# EAGLE schematic 8_RGB_SMD_LEDs (EAGLE 6.4)
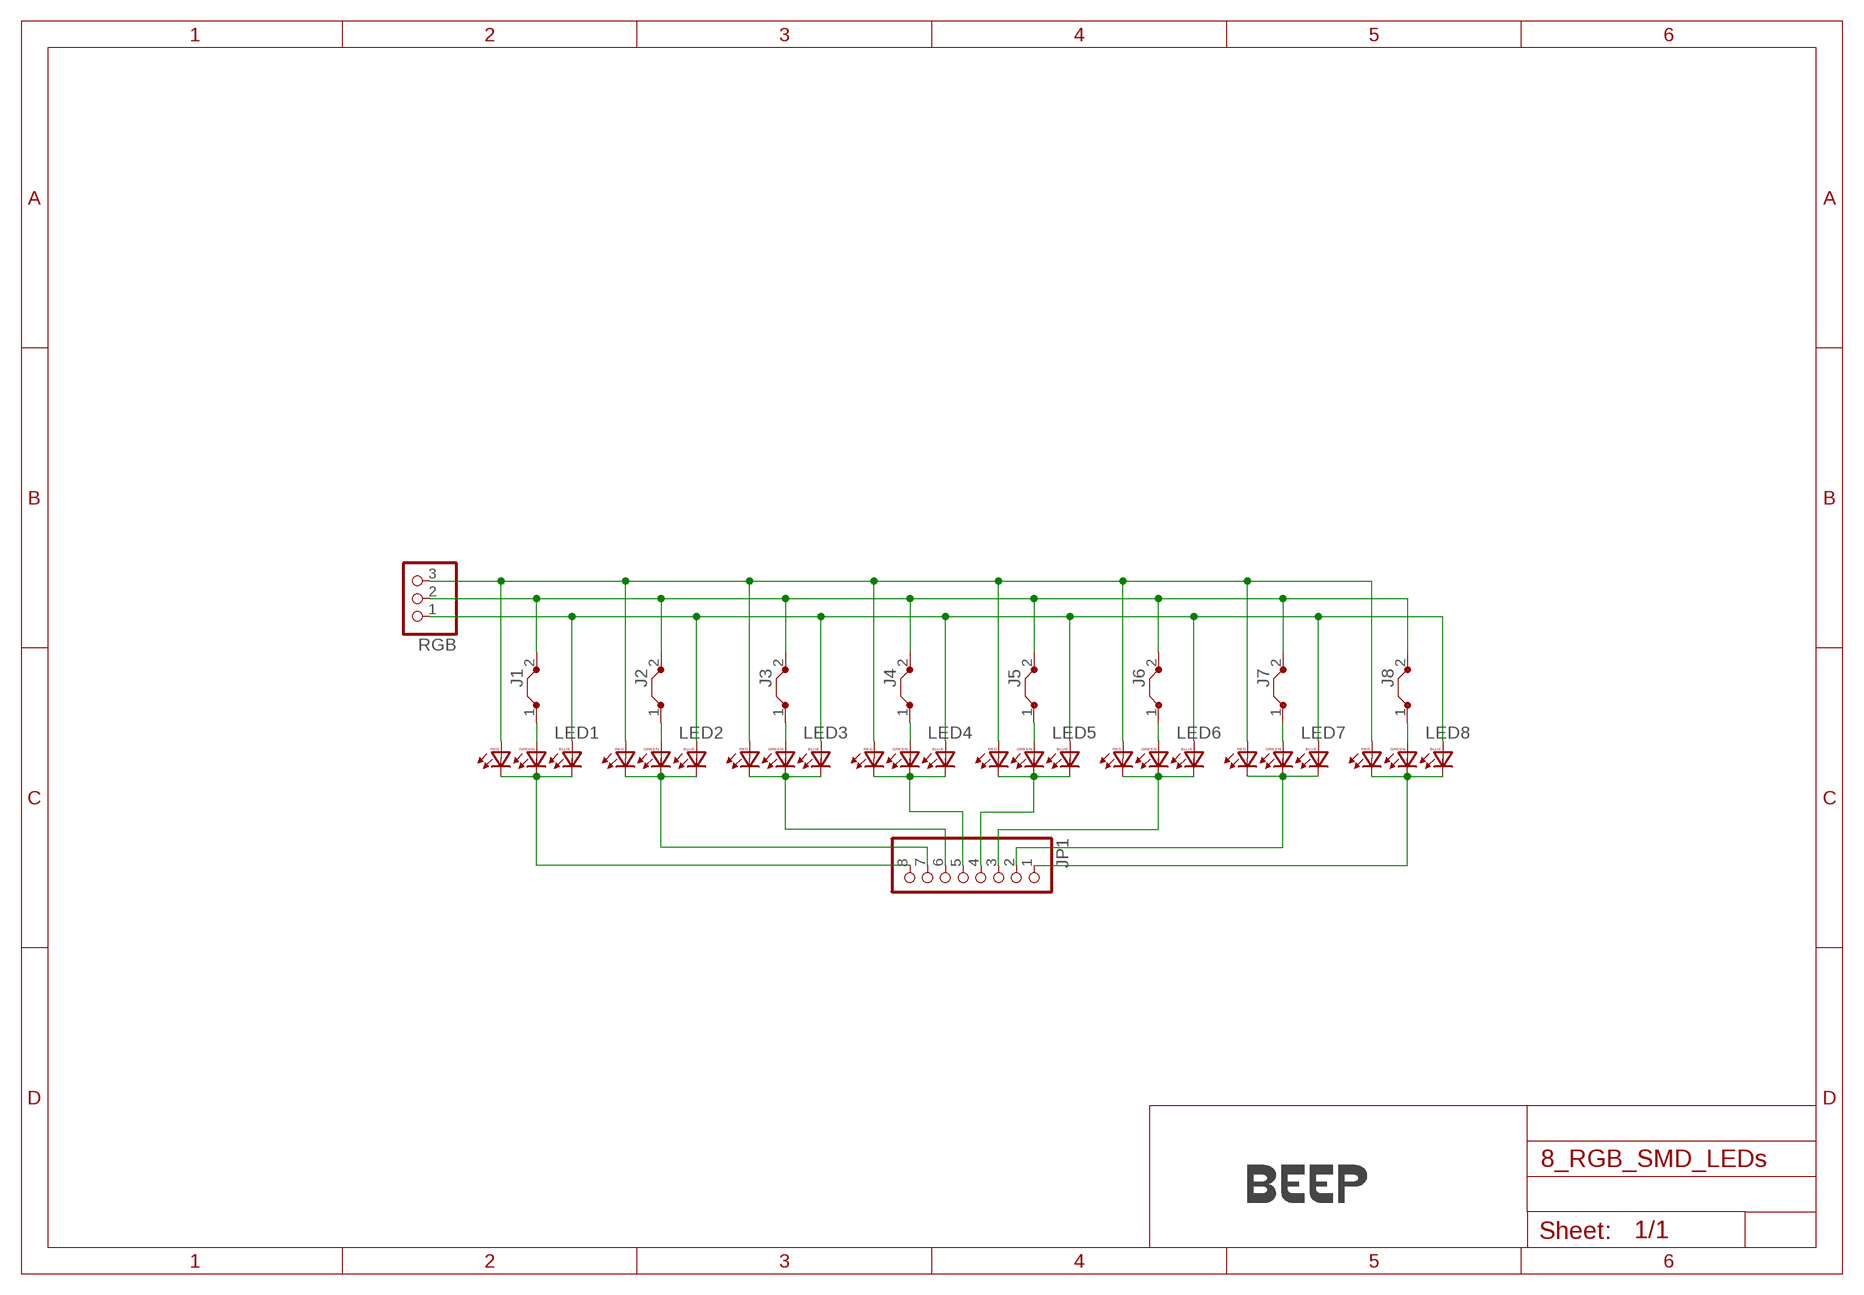
[diagram p0: schematic, sheet 1]

## Parts
J1  J7MM  [07]
J2  J7MM  [07]
J3  J7MM  [07]
J4  J7MM  [07]
J5  J7MM  [07]
J6  J7MM  [07]
J7  J7MM  [07]
J8  J7MM  [07]
JP1  PINHD-1X8  [1X08]
LED1  F503605050  [5050LED]
LED2  F503605050  [5050LED]
LED3  F503605050  [5050LED]
LED4  F503605050  [5050LED]
LED5  F503605050  [5050LED]
LED6  F503605050  [5050LED]
LED7  F503605050  [5050LED]
LED8  F503605050  [5050LED]
RGB  PINHD-1X3  [1X03]
U$5  LOGO-COPPER7  [COPPER7]

## Nets
N$2: J1.2 J2.2 J3.2 J4.2 J5.2 J6.2 J7.2 J8.2 RGB.2
N$5: J1.1 LED1.G1(GA)
N$7: JP1.8 LED1.B2(BC) LED1.G2(GC) LED1.R2(RC)
N$8: JP1.7 LED2.B2(BC) LED2.G2(GC) LED2.R2(RC)
N$9: JP1.6 LED3.B2(BC) LED3.G2(GC) LED3.R2(RC)
N$10: JP1.5 LED4.B2(BC) LED4.G2(GC) LED4.R2(RC)
N$12: J2.1 LED2.G1(GA)
N$14: JP1.4 LED5.B2(BC) LED5.G2(GC) LED5.R2(RC)
N$15: JP1.3 LED6.B2(BC) LED6.G2(GC) LED6.R2(RC)
N$16: JP1.2 LED7.B2(BC) LED7.G2(GC) LED7.R2(RC)
N$17: JP1.1 LED8.B2(BC) LED8.G2(GC) LED8.R2(RC)
N$19: J3.1 LED3.G1(GA)
N$22: J4.1 LED4.G1(GA)
N$25: J5.1 LED5.G1(GA)
N$28: J6.1 LED6.G1(GA)
N$31: J7.1 LED7.G1(GA)
N$33: LED1.R1(RA) LED2.R1(RA) LED3.R1(RA) LED4.R1(RA) LED5.R1(RA) LED6.R1(RA) LED7.R1(RA) LED8.R1(RA) RGB.3
N$34: J8.1 LED8.G1(GA)
N$35: LED1.B1(BA) LED2.B1(BA) LED3.B1(BA) LED4.B1(BA) LED5.B1(BA) LED6.B1(BA) LED7.B1(BA) LED8.B1(BA) RGB.1

## Library data of the parts
J1-J8 = jumper:J: Bridge
JP1 = pinhead:PINHD-1X8: PIN HEADER
LED1-LED8 = BEEP:F50360: Full color Z-Power LED RGB P5-II Series Source: http://www.seoulsemicon.co.kr .. F50360.pdf
RGB = pinhead:PINHD-1X3: PIN HEADER
U$5 = Branding:LOGO-COPPER